# Altium schematic sheet MaWei.SchDoc
size A4
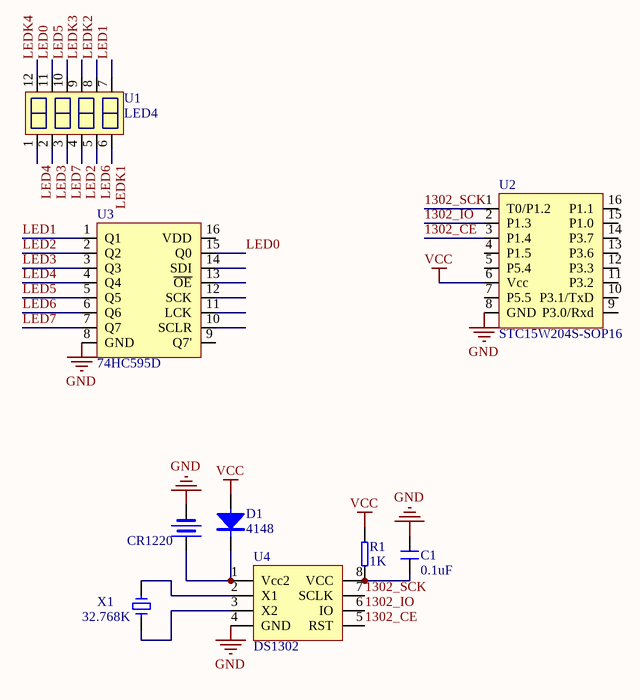
[diagram p0: MaWei.SchDoc]

## Parts
BT1  CR1220  [CR1220]
C1  0.1uF  [RES]
D1  4148  [LED0805]
R1  1K  [RES0603]
U1  LED4
U2  STC15W204S-SOP16  [SOP16]
U3  74HC595D  [SOP16]
U4  DS1302  [SOP8]
X1  32.768K  [FC-135]

## Nets
GND: BT1.2(-) C1.2 U2.8(GND) U3.8(GND) U4.4(GND)
VCC: D1.1(A) R1.2 U2.6(Vcc)
1302_CE: U2.3(P1.4) U4.5(RST)
1302_IO: U2.2(P1.3) U4.6(IO)
1302_SCK: U2.1(T0/P1.2) U4.7(SCLK)
LED0: U1.11 U3.15(Q0)
LED1: U1.7 U3.1(Q1)
LED2: U1.4 U3.2(Q2)
LED3: U1.2 U3.3(Q3)
LED4: U1.1 U3.4(Q4)
LED5: U1.10 U3.5(Q5)
LED6: U1.5 U3.6(Q6)
LED7: U1.3 U3.7(Q7)
LEDK1: U1.6
LEDK2: U1.8
LEDK3: U1.9
LEDK4: U1.12
NetBT1_1: BT1.1(+) D1.2(K) U4.1(Vcc2)
NetC1_1: C1.1 R1.1 U4.8(VCC)
NetU4_2: U4.2(X1) X1.2
NetU4_3: U4.3(X2) X1.1

Not connected (* = marked no-connect by the designer): U2 4(P1.5) 5(P5.4) 7(P5.5) 9(P3.0/Rxd) 10(P3.1/TxD) 11(P3.2) 12(P3.3) 13(P3.6) 14(P3.7) 15(P1.0) 16(P1.1); U3 9(Q7') 10(SCLR) 11(LCK) 12(SCK) 13(~{OE}) 14(SDI) 16(VDD)

## Library data of the parts
BT1 = BATTERY
C1 = CAP2
D1 = Diode
R1 = RES
X1 = XTAL